# EAGLE design deviantlcd (EAGLE 6.3)
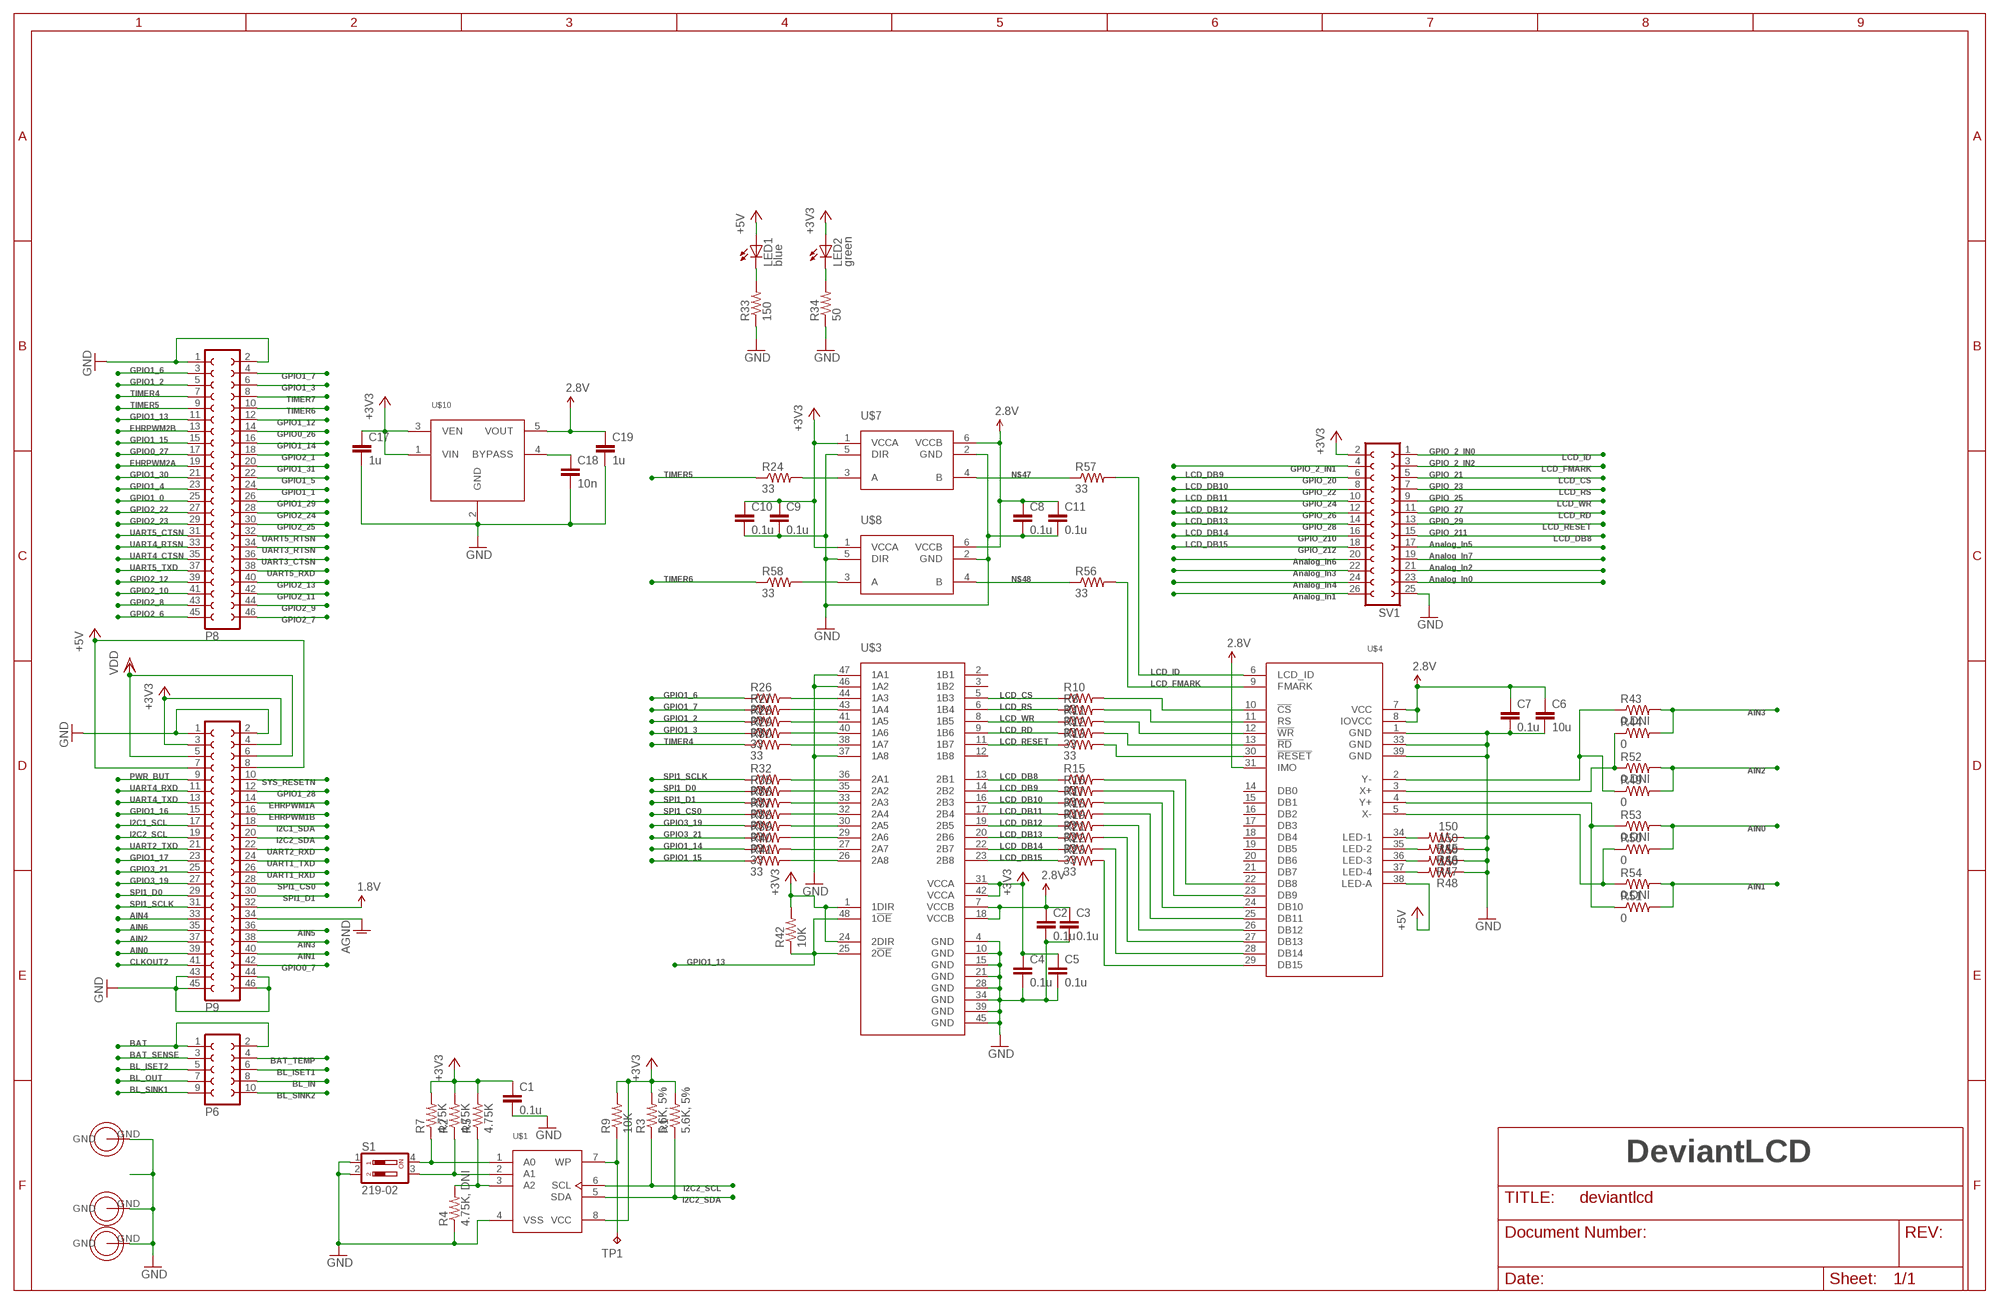
[diagram p0: schematic, sheet 1]

## Parts
C1  0.1u  C-EUC0603  [C0603]
C2  0.1u  C-EUC0603  [C0603]
C3  0.1u  C-EUC0603  [C0603]
C4  0.1u  C-EUC0603  [C0603]
C5  0.1u  C-EUC0603  [C0603]
C6  10u  C-EUC0603  [C0603]
C7  0.1u  C-EUC0603  [C0603]
C8  0.1u  C-EUC0603  [C0603]
C9  0.1u  C-EUC0603  [C0603]
C10  0.1u  C-EUC0603  [C0603]
C11  0.1u  C-EUC0603  [C0603]
C17  1u  C-EUC0603  [C0603]
C18  10n  C-EUC0603  [C0603]
C19  1u  C-EUC0603  [C0603]
H1  HOLE  [HOLE]
H3  HOLE  [HOLE]
H4  HOLE  [HOLE]
LED1  blue  LEDCHIPLED_0603  [CHIPLED_0603]
LED2  green  LEDCHIPLED_0603  [CHIPLED_0603]
P6  FE05-2  [FE05-2]
P8  FE23-2  [FE23-2]
P9  FE23-2  [FE23-2]
R1  5.6K, 5%  R-US_R0603  [R0603]
R2  4.75K  R-US_R0603  [R0603]
R3  5.6K, 5%  R-US_R0603  [R0603]
R4  4.75K, DNI  R-US_R0603  [R0603]
R5  4.75K  R-US_R0603  [R0603]
R7  4.75K  R-US_R0603  [R0603]
R8  33  R-US_R0402  [R0402]
R9  10K  R-US_R0603  [R0603]
R10  33  R-US_R0402  [R0402]
R11  33  R-US_R0402  [R0402]
R12  33  R-US_R0402  [R0402]
R13  33  R-US_R0402  [R0402]
R15  33  R-US_R0402  [R0402]
R16  33  R-US_R0402  [R0402]
R17  33  R-US_R0402  [R0402]
R18  33  R-US_R0402  [R0402]
R19  33  R-US_R0402  [R0402]
R21  33  R-US_R0402  [R0402]
R22  33  R-US_R0402  [R0402]
R23  33  R-US_R0402  [R0402]
R24  33  R-US_R0402  [R0402]
R26  33  R-US_R0402  [R0402]
R27  33  R-US_R0402  [R0402]
R28  33  R-US_R0402  [R0402]
R29  33  R-US_R0402  [R0402]
R30  33  R-US_R0402  [R0402]
R32  33  R-US_R0402  [R0402]
R33  150  R-US_R0603  [R0603]
R34  50  R-US_R0603  [R0603]
R35  33  R-US_R0402  [R0402]
R36  33  R-US_R0402  [R0402]
R37  33  R-US_R0402  [R0402]
R38  33  R-US_R0402  [R0402]
R39  33  R-US_R0402  [R0402]
R40  33  R-US_R0402  [R0402]
R41  33  R-US_R0402  [R0402]
R42  10K  R-US_R0402  [R0402]
R43  0,DNI  R-US_R0402  [R0402]
R44  0  R-US_R0402  [R0402]
R45  150  R-US_R0603  [R0603]
R46  150  R-US_R0603  [R0603]
R47  150  R-US_R0603  [R0603]
R48  150  R-US_R0603  [R0603]
R49  0  R-US_R0402  [R0402]
R50  0  R-US_R0402  [R0402]
R51  0  R-US_R0402  [R0402]
R52  0,DNI  R-US_R0402  [R0402]
R53  0,DNI  R-US_R0402  [R0402]
R54  0,DNI  R-US_R0402  [R0402]
R56  33  R-US_R0402  [R0402]
R57  33  R-US_R0402  [R0402]
R58  33  R-US_R0402  [R0402]
S1  219-02  [CTS-219-02]
SV1  FE13-2  [FE13-2]
TP1  TPB2,54  [B2,54]
U$1  CAT24C256  [SOIC8]
U$3  SN74LVCH16T245  [TSSOP48]
U$4  NHD-2.4-240320SF-CTXI  [NHD-2.4-240320SF-CTXI]
U$7  SN74LVC1T45  [SOT23-6]
U$8  SN74LVC1T45  [SOT23-6]
U$10  LP3985  [SOT23-5]

## Nets
1.8V: P9.32
2.85V [pwr]: C6.1 C7.1 C8.1 C11.1 C19.1 U$4.7(VCC) U$4.8(IOVCC) U$4.31(IMO) U$7.6(VCCB) U$8.6(VCCB) U$10.5(VOUT) ; supply symbol labelled 2.8V
+3V3 [pwr]: C1.1 C4.1 C5.1 C9.1 C10.1 C17.1 LED2.A P9.3 P9.4 R1.2 R2.2 R3.2 R5.2 R7.2 R9.2 R42.2 SV1.2 U$1.8(VCC) U$3.1(1DIR) U$3.24(2DIR) U$3.31(VCCA) U$3.42(VCCA) U$7.1(VCCA) U$8.1(VCCA) U$10.1(VIN) U$10.3(VEN)
+5V [pwr]: LED1.A P9.7 P9.8 U$4.38(LED-A)
AGND: P9.34
AIN0: P9.39 R50.2 R53.2
AIN1: P9.40 R51.2 R54.2
AIN2: P9.37 R49.2 R52.2
AIN3: P9.38 R43.2 R44.2
AIN4: P9.33
AIN5: P9.36
AIN6: P9.35
BAT: P6.1 P6.2
BAT_SENSE: P6.3
BAT_TEMP: P6.4
BL_IN: P6.8
BL_ISET1: P6.6
BL_ISET2: P6.5
BL_OUT: P6.7
BL_SINK1: P6.9
BL_SINK2: P6.10
CLKOUT2: P9.41
EHRPWM1A: P9.14
EHRPWM1B: P9.16
EHRPWM2A: P8.19
EHRPWM2B: P8.13
FF: SV1.4
GND [pwr]: C1.2 C2.2 C3.2 C4.2 C5.2 C6.2 C7.2 C8.2 C9.2 C10.2 C11.2 C17.2 C18.2 C19.2 H1.GND H3.GND H4.GND P8.1 P8.2 P9.1 P9.2 P9.43 P9.44 P9.45 P9.46 R4.1 R33.1 R34.1 R45.1 R46.1 R47.1 R48.1 S1.1 S1.2 SV1.25 U$1.4(VSS) U$3.4(GND) U$3.10(GND) U$3.15(GND) U$3.21(GND) U$3.28(GND) U$3.34(GND) U$3.37(1A8) U$3.39(GND) U$3.45(GND) U$3.46(1A2) U$3.47(1A1) U$4.1(GND) U$4.33(GND) U$4.39(GND) U$7.2(GND) U$7.5(DIR) U$8.2(GND) U$8.5(DIR) U$10.2(GND)
GPIO0_7: P9.42
GPIO0_26: P8.14
GPIO0_27: P8.17
GPIO1_0: P8.25
GPIO1_1: P8.24
GPIO1_2: P8.5 R28.1
GPIO1_3: P8.6 R29.1
GPIO1_4: P8.23
GPIO1_5: P8.22
GPIO1_6: P8.3 R26.1
GPIO1_7: P8.4 R27.1
GPIO1_12: P8.12
GPIO1_13: P8.11 R42.1 U$3.25(2!OE) U$3.48(1!OE)
GPIO1_14: P8.16 R40.1
GPIO1_15: P8.15 R41.1
GPIO1_16: P9.15
GPIO1_17: P9.23
GPIO1_28: P9.12
GPIO1_29: P8.26
GPIO1_30: P8.21
GPIO1_31: P8.20
GPIO2_1: P8.18
GPIO2_6: P8.45
GPIO2_7: P8.46
GPIO2_8: P8.43
GPIO2_9: P8.44
GPIO2_10: P8.41
GPIO2_11: P8.42
GPIO2_12: P8.39
GPIO2_13: P8.40
GPIO2_22: P8.27
GPIO2_23: P8.29
GPIO2_24: P8.28
GPIO2_25: P8.30
GPIO3_19: P9.27 R38.1
GPIO3_21: P9.25 R39.1
I2C1_SCL: P9.17
I2C1_SDA: P9.18
I2C2_SCL: P9.19 R3.1 U$1.6(SCL)
I2C2_SDA: P9.20 R1.1 U$1.5(SDA)
LCD_CS: R10.1 SV1.5 U$3.5(1B3)
LCD_DB8: R15.1 SV1.15 U$3.13(2B1)
LCD_DB9: R16.1 SV1.6 U$3.14(2B2)
LCD_DB10: R17.1 SV1.8 U$3.16(2B3)
LCD_DB11: R18.1 SV1.10 U$3.17(2B4)
LCD_DB12: R19.1 SV1.12 U$3.19(2B5)
LCD_DB13: R21.1 SV1.14 U$3.20(2B6)
LCD_DB14: R22.1 SV1.16 U$3.22(2B7)
LCD_DB15: R23.1 SV1.18 U$3.23(2B8)
LCD_FMARK: R56.2 SV1.3 U$4.9(FMARK)
LCD_ID: R57.2 SV1.1 U$4.6(LCD_ID)
LCD_RD: R12.1 SV1.11 U$3.9(1B6)
LCD_RESET: R13.1 SV1.13 U$3.11(1B7)
LCD_RS: R8.1 SV1.7 U$3.6(1B4)
LCD_WR: R11.1 SV1.9 U$3.8(1B5)
N$1: R7.1 S1.4 U$1.1(A0)
N$2: R2.1 S1.3 U$1.2(A1)
N$3: R4.2 R5.1 U$1.3(A2)
N$5: R9.1 TP1.TP U$1.7(WP)
N$14: SV1.20
N$15: SV1.22
N$16: SV1.24
N$17: SV1.26
N$25: SV1.17
N$26: SV1.19
N$27: SV1.21
N$28: SV1.23
N$29: LED1.C R33.2
N$30: LED2.C R34.2
N$31: R24.2 U$7.3(A)
N$32: R58.2 U$8.3(A)
N$33: R26.2 U$3.44(1A3)
N$34: R27.2 U$3.43(1A4)
N$35: R28.2 U$3.41(1A5)
N$36: R29.2 U$3.40(1A6)
N$37: R30.2 U$3.38(1A7)
N$39: R32.2 U$3.36(2A1)
N$40: R35.2 U$3.35(2A2)
N$41: R36.2 U$3.33(2A3)
N$42: R37.2 U$3.32(2A4)
N$43: R38.2 U$3.30(2A5)
N$44: R39.2 U$3.29(2A6)
N$45: R40.2 U$3.27(2A7)
N$46: R41.2 U$3.26(2A8)
N$47: R57.1 U$7.4(B)
N$48: R56.1 U$8.4(B)
N$81: R10.2 U$4.10(!CS)
N$82: R8.2 U$4.11(RS)
N$83: R11.2 U$4.12(!WR)
N$84: R12.2 U$4.13(!RD)
N$85: R13.2 U$4.30(!RESET)
N$87: R23.2 U$4.29(DB15)
N$88: R22.2 U$4.28(DB14)
N$89: R21.2 U$4.27(DB13)
N$90: R19.2 U$4.26(DB12)
N$91: R18.2 U$4.25(DB11)
N$92: R17.2 U$4.24(DB10)
N$93: R16.2 U$4.23(DB9)
N$94: R15.2 U$4.22(DB8)
N$97: C18.1 U$10.4(BYPASS)
N$99: R45.2 U$4.34(LED-1)
N$100: R46.2 U$4.35(LED-2)
N$101: R47.2 U$4.36(LED-3)
N$102: R48.2 U$4.37(LED-4)
N$103: R43.1 R49.1 U$4.2(Y-)
N$104: R44.1 R52.1 U$4.3(X+)
N$105: R51.1 R53.1 U$4.4(Y+)
N$106: R50.1 R54.1 U$4.5(X-)
PWR_BUT: P9.9
SPI1_CS0: P9.28 R37.1
SPI1_D0: P9.29 R35.1
SPI1_D1: P9.30 R36.1
SPI1_SCLK: P9.31 R32.1
SYS_RESETN: P9.10
TIMER4: P8.7 R30.1
TIMER5: P8.9 R24.1
TIMER6: P8.10 R58.1
TIMER7: P8.8
UART1_RXD: P9.26
UART1_TXD: P9.24
UART2_RXD: P9.22
UART2_TXD: P9.21
UART3_CTSN: P8.36
UART3_RTSN: P8.34
UART4_CTSN: P8.35
UART4_RTSN: P8.33
UART4_RXD: P9.11
UART4_TXD: P9.13
UART5_CTSN: P8.31
UART5_RTSN: P8.32
UART5_RXD: P8.38
UART5_TXD: P8.37
VCCB@2: C2.1 C3.1 U$3.7(VCCB) U$3.18(VCCB) ; supply symbol labelled 2.8V
VDD: P9.5 P9.6
Unconnected: U$3.2(1B1) U$3.3(1B2) U$3.12(1B8) U$4.14(DB0) U$4.15(DB1) U$4.16(DB2) U$4.17(DB3) U$4.18(DB4) U$4.19(DB5) U$4.20(DB6) U$4.21(DB7)

## Notes on the sheet
- GPIO_2_IN0
- GPIO_2_IN1 | GPIO_2_IN2
- GPIO_20 | GPIO_21
- GPIO_22 | GPIO_23
- GPIO_24 | GPIO_25
- GPIO_26 | GPIO_27
- GPIO_28 | GPIO_29
- GPIO_210 | GPIO_211
- GPIO_212 | Analog_In5
- Analog_In6 | Analog_In7
- Analog_In3 | Analog_In2
- Analog_In4 | Analog_In0
- Analog_In1
- DeviantLCD

## Library data of the parts
C1-C5 C7-C11 = rcl:C-EU: CAPACITOR, European symbol; MPN: VJ0603V104ZXXCW1BC
C6 = rcl:C-EU: CAPACITOR, European symbol; MPN: LMK107BBJ106MALT
C17 C19 = rcl:C-EU: CAPACITOR, European symbol; MPN: C1608X7R1C105K
C18 = rcl:C-EU: CAPACITOR, European symbol; MPN: VJ0603Y103KXACW1BC
H1 H3 H4 = BoneCapeParts:HOLE
LED1 = led:LED: LED OSRAM: - CHIPLED LG R971, LG N971, LY N971, LG Q971, LY Q971, LO R971, LY R971 LH N974, LH R974 LS Q976, LO Q976, LY Q976 LO Q996 - Hyper CHIPLED LW Q18S LB Q993, LB Q99A, LB R99A - SideLED LS A670, LO A670, LY A670, LG A670, LP A670 LB A673, LV A673, LT A673, LW A673 LH A674 LY A675 LS A676, LA A676, LO A676, LY A676, LW A676 LS A679, LY A679, LG A679 - Hyper Micro SIDELED® LS Y876, LA Y876, LO Y876, LY Y876 LT Y87S - SmartLED LW L88C, LW L88S LB L89C, LB L89S, LG L890 LS L89K, LO L89K, LY L89K LS L896, LA L896, LO L896, LY L896 - TOPLED LS T670, LO T670, LY T670, LG T670, LP T670 LSG T670, LSP T670, LSY T670, LOP T670, LYG T670 LG T671, LOG T671, LSG T671 LB T673, LV T673, LT T673, LW T673 LH T674 LS T676, LA T676, LO T676, LY T676, LB T676, LH T676, LSB T676, LW T676 LB T67C, LV T67C, LT T67C, LS T67K, LO T67K, LY T67K, LW E67C LS E67B, LA E67B, LO E67B, LY E67B, LB E67C, LV E67C, LT E67C LW T67C LS T679, LY T679, LG T679 LS T770, LO T770, LY T770, LG T770, LP T770 LB T773, LV T773, LT T773, LW T773 LH T774 LS E675, LA E675, LY E675, LS T675 LS T776, LA T776, LO T776, LY T776, LB T776 LHGB T686 LT T68C, LB T68C - Hyper Mini TOPLED® LB M676 - Mini TOPLED Santana® LG M470 LS M47K, LO M47K, LY M47K Source: http://www.osram.convergy.de LUXEON: - LUMILED® LXK2-PW12-R00, LXK2-PW12-S00, LXK2-PW14-U00, LXK2-PW14-V00 LXK2-PM12-R00, LXK2-PM12-S00, LXK2-PM14-U00 LXK2-PE12-Q00, LXK2-PE12-R00, LXK2-PE12-S00, LXK2-PE14-T00, LXK2-PE14-U00 LXK2-PB12-K00, LXK2-PB12-L00, LXK2-PB12-M00, LXK2-PB14-N00, LXK2-PB14-P00, LXK2-PB14-Q00 LXK2-PR12-L00, LXK2-PR12-M00, LXK2-PR14-Q00, LXK2-PR14-R00 LXK2-PD12-Q00, LXK2-PD12-R00, LXK2-PD12-S00 LXK2-PH12-R00, LXK2-PH12-S00 LXK2-PL12-P00, LXK2-PL12-Q00, LXK2-PL12-R00 Source: www.luxeon.com KINGBRIGHT: KA-3528ASYC Source: www.kingbright.com; MPN: HT-193NB-5589
LED2 = led:LED: LED OSRAM: - CHIPLED LG R971, LG N971, LY N971, LG Q971, LY Q971, LO R971, LY R971 LH N974, LH R974 LS Q976, LO Q976, LY Q976 LO Q996 - Hyper CHIPLED LW Q18S LB Q993, LB Q99A, LB R99A - SideLED LS A670, LO A670, LY A670, LG A670, LP A670 LB A673, LV A673, LT A673, LW A673 LH A674 LY A675 LS A676, LA A676, LO A676, LY A676, LW A676 LS A679, LY A679, LG A679 - Hyper Micro SIDELED® LS Y876, LA Y876, LO Y876, LY Y876 LT Y87S - SmartLED LW L88C, LW L88S LB L89C, LB L89S, LG L890 LS L89K, LO L89K, LY L89K LS L896, LA L896, LO L896, LY L896 - TOPLED LS T670, LO T670, LY T670, LG T670, LP T670 LSG T670, LSP T670, LSY T670, LOP T670, LYG T670 LG T671, LOG T671, LSG T671 LB T673, LV T673, LT T673, LW T673 LH T674 LS T676, LA T676, LO T676, LY T676, LB T676, LH T676, LSB T676, LW T676 LB T67C, LV T67C, LT T67C, LS T67K, LO T67K, LY T67K, LW E67C LS E67B, LA E67B, LO E67B, LY E67B, LB E67C, LV E67C, LT E67C LW T67C LS T679, LY T679, LG T679 LS T770, LO T770, LY T770, LG T770, LP T770 LB T773, LV T773, LT T773, LW T773 LH T774 LS E675, LA E675, LY E675, LS T675 LS T776, LA T776, LO T776, LY T776, LB T776 LHGB T686 LT T68C, LB T68C - Hyper Mini TOPLED® LB M676 - Mini TOPLED Santana® LG M470 LS M47K, LO M47K, LY M47K Source: http://www.osram.convergy.de LUXEON: - LUMILED® LXK2-PW12-R00, LXK2-PW12-S00, LXK2-PW14-U00, LXK2-PW14-V00 LXK2-PM12-R00, LXK2-PM12-S00, LXK2-PM14-U00 LXK2-PE12-Q00, LXK2-PE12-R00, LXK2-PE12-S00, LXK2-PE14-T00, LXK2-PE14-U00 LXK2-PB12-K00, LXK2-PB12-L00, LXK2-PB12-M00, LXK2-PB14-N00, LXK2-PB14-P00, LXK2-PB14-Q00 LXK2-PR12-L00, LXK2-PR12-M00, LXK2-PR14-Q00, LXK2-PR14-R00 LXK2-PD12-Q00, LXK2-PD12-R00, LXK2-PD12-S00 LXK2-PH12-R00, LXK2-PH12-S00 LXK2-PL12-P00, LXK2-PL12-Q00, LXK2-PL12-R00 Source: www.luxeon.com KINGBRIGHT: KA-3528ASYC Source: www.kingbright.com; MPN: LG Q971-KN-1
P6 = con-lsta:FE05-2: FEMALE HEADER; MPN: TSHC-105-D-03-255-GT-LF; OC_FARNELL: unknown; OC_NEWARK: unknown
P8 P9 = BoneCapeParts:FE23-2: FEMALE HEADER; MPN: TSHC-123-D-03-255-GT-LF; OC_FARNELL: unknown; OC_NEWARK: unknown
R1 R3 = rcl:R-US_: RESISTOR, American symbol; MPN: RK73B1JTTDD562J
R2 R4 R5 R7 = rcl:R-US_: RESISTOR, American symbol; MPN: CR0603-FX-4751GLF
R8 R10-R13 R15-R19 R21-R24 R26 R27 R29 R30 R32 R35-R41 R56-R58 = rcl:R-US_: RESISTOR, American symbol; MPN: CR0402-JW-330GLF
R9 R42 = rcl:R-US_: RESISTOR, American symbol; MPN: WR06X1002FTL
R28 = rcl:R-US_: RESISTOR, American symbol
R33 R45-R48 = rcl:R-US_: RESISTOR, American symbol; MPN: 302-150-RC
R34 = rcl:R-US_: RESISTOR, American symbol; MPN: 302-49.9-RC
R43 R44 R49-R54 = rcl:R-US_: RESISTOR, American symbol; MPN: ERJ-2GE0R00X
S1 = switch-dil:219-02*: Surface Mount DIP Switch Series 219 SMT CTS Electronic Components Sourc: www.ctscorp.com; MPN: 219-2MST; OC_FARNELL: unknown; OC_NEWARK: unknown
SV1 = BoneCapeParts:FE13-2: FEMALE HEADER; MPN: NPTC132KFMS-RC
TP1 = testpad:TP: Test pad
U$1 = BoneCapeParts:CAT24C256; MPN: CAT24C256WI-GT3
U$3 = BoneCapeParts:SN74LVCH16T245; MPN: SN74LVCH16T245DGGR
U$4 = BoneCapeParts:NHD-2.4-240320SF-CTXI; MPN: NHD-2.4-240320SF-CTXI#-T1
U$7 U$8 = BoneCapeParts:SN74LVC1T45; MPN: SN74LVC1T45DBVR
U$10 = BoneCapeParts:LP3985; MPN: LP3985IM5-2.8/NOPB

## Net classes
0 default: width 0.152 mm, drill 0.381 mm, clearance 0.152 mm
1 pwr: width 0.254 mm, drill 0.381 mm, clearance 0.152 mm

## Board
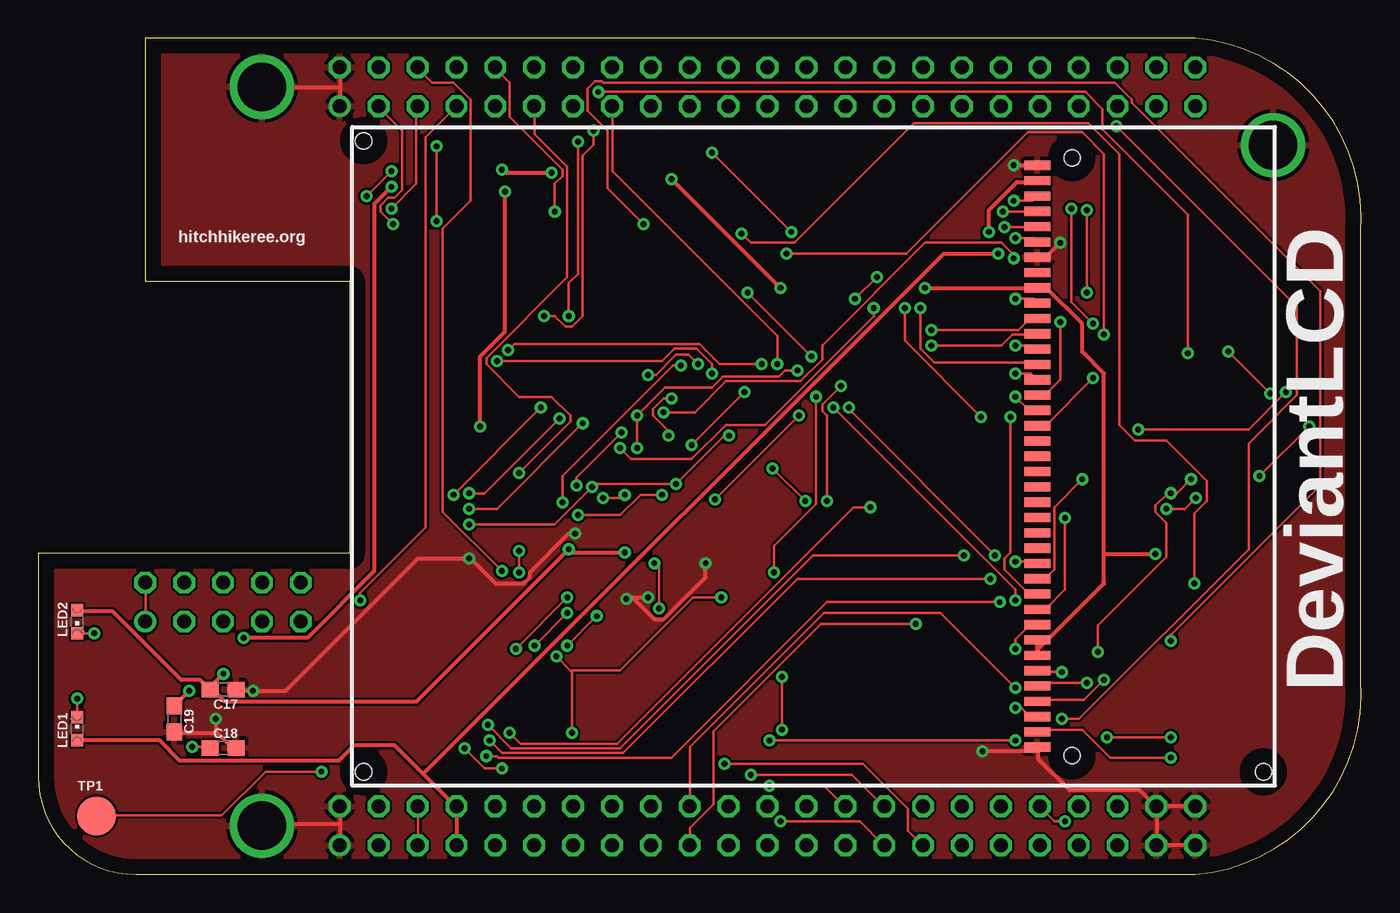
[diagram p1: board, top side]
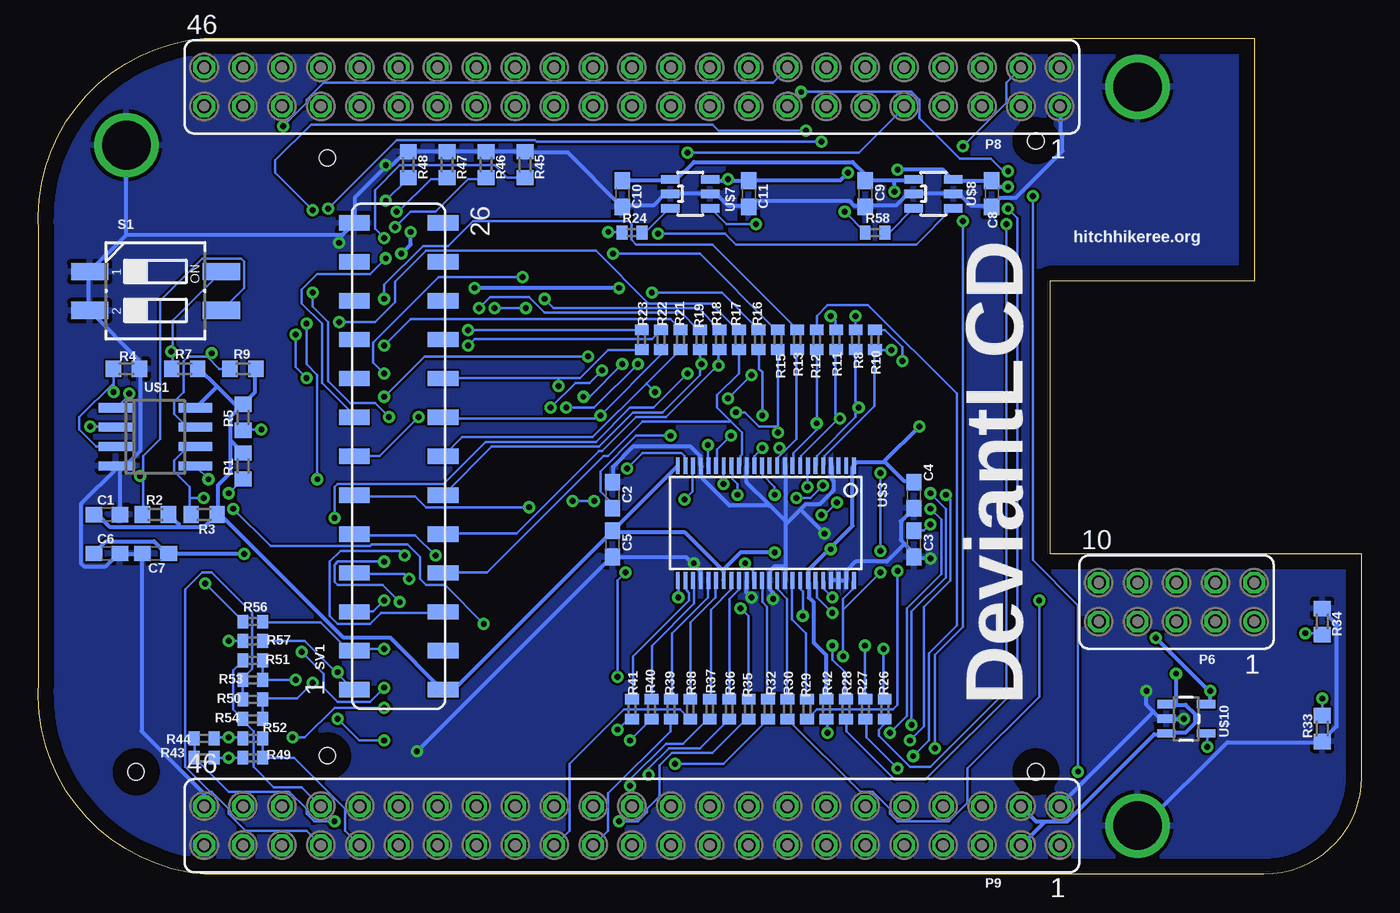
[diagram p2: board, bottom side, seen from below]

Size 86.4 x 54.61 mm. Coordinates in mm from the lower left corner, seen from the top.
Outline: 0,20.95 0,6.35 arc90 6.35,0 75.56,0 arc90 86.36,12.7 86.36,41.91 arc90 75.56,54.61 6.99,54.61 6.99,38.73 20.32,38.73 20.32,20.95 0,20.95
Copper layers (1*16): Top 0.035mm / dielectric 1.5mm / Bottom 0.035mm
Design rules "default *": minimum track width 6mil, minimum drill 15mil, track to track 6mil, track to pad 6mil, pad to pad 6mil, via to via 6mil, smd to smd 6mil, copper to edge 40mil, drill to drill 8mil, minimum pad ring 10mil, minimum via ring 8mil, stop-mask expansion 4mil, vias tented up to drill 20mil, thermal gap 10mil

### Footprints (pad centres in the part's own frame; a part is rotated, then mirrored left to right if it is on the bottom)
C0603 = smd 1.1 x 1: 1 -0.85,0; 2 0.85,0
HOLE = drill 3.175: GND 0,0
CHIPLED_0603 = smd 0.8 x 0.8: A 0,-0.75; C 0,0.75
FE05-2 = drill 0.914: 1 -5.08,1.27 | drill 0.914 octagon: 2 -5.08,-1.27; 3 -2.54,1.27; 4 -2.54,-1.27; 5 0,1.27; 6 0,-1.27; 7 2.54,1.27; 8 2.54,-1.27; 9 5.08,1.27; 10 5.08,-1.27
FE23-2 = drill 0.914: 1 -24.13,1.27 | drill 0.914 octagon: 2 -24.13,-1.27; 3 -21.59,1.27; 4 -21.59,-1.27; 5 -19.05,1.27; 6 -19.05,-1.27; 7 -16.51,1.27; 8 -16.51,-1.27; 9 -13.97,1.27; 10 -13.97,-1.27; 11 -11.43,1.27; 12 -11.43,-1.27; 13 -8.89,1.27; 14 -8.89,-1.27; 15 -6.35,1.27; 16 -6.35,-1.27; 17 -3.81,1.27; 18 -3.81,-1.27; 19 -1.27,1.27; 20 -1.27,-1.27; 21 1.27,1.27; 22 1.27,-1.27; 23 3.81,1.27; 24 3.81,-1.27; 25 6.35,1.27; 26 6.35,-1.27; 27 8.89,1.27; 28 8.89,-1.27; 29 11.43,1.27; 30 11.43,-1.27; 31 13.97,1.27; 32 13.97,-1.27; 33 16.51,1.27; 34 16.51,-1.27; 35 19.05,1.27; 36 19.05,-1.27; 37 21.59,1.27; 38 21.59,-1.27; 39 24.13,1.27; 40 24.13,-1.27; 41 26.67,1.27; 42 26.67,-1.27; 43 29.21,1.27; 44 29.21,-1.27; 45 31.75,1.27; 46 31.75,-1.27
R0603 = smd 1 x 1.1: 1 -0.85,0; 2 0.85,0
R0402 = smd 0.7 x 0.9: 1 -0.65,0; 2 0.65,0
CTS-219-02 = smd 1.13 x 2.44: 1 -1.27,-4.3; 2 1.27,-4.3; 3 1.27,4.3; 4 -1.27,4.3
FE13-2 = smd 1 x 2: 1 -15.24,2.9; 2 -15.24,-2.9; 3 -12.7,2.9; 4 -12.7,-2.9; 5 -10.16,2.9; 6 -10.16,-2.9; 7 -7.62,2.9; 8 -7.62,-2.9; 9 -5.08,2.9; 10 -5.08,-2.9; 11 -2.54,2.9; 12 -2.54,-2.9; 13 0,2.9; 14 0,-2.9; 15 2.54,2.9; 16 2.54,-2.9; 17 5.08,2.9; 18 5.08,-2.9; 19 7.62,2.9; 20 7.62,-2.9; 21 10.16,2.9; 22 10.16,-2.9; 23 12.7,2.9; 24 12.7,-2.9; 25 15.24,2.9; 26 15.24,-2.9
B2,54 = smd 2.54 x 2.54: TP 0,0
SOIC8 = smd 0.6 x 2.2: 1 -1.905,-2.6; 2 -0.635,-2.6; 3 0.635,-2.6; 4 1.905,-2.6; 5 1.905,2.6; 6 0.635,2.6; 7 -0.635,2.6; 8 -1.905,2.6
TSSOP48 = smd 0.25 x 1.1: 1 0.75,1.25; 2 1.25,1.25; 3 1.75,1.25; 4 2.25,1.25; 5 2.75,1.25; 6 3.25,1.25; 7 3.75,1.25; 8 4.25,1.25; 9 4.75,1.25; 10 5.25,1.25; 11 5.75,1.25; 12 6.25,1.25; 13 6.75,1.25; 14 7.25,1.25; 15 7.75,1.25; 16 8.25,1.25; 17 8.75,1.25; 18 9.25,1.25; 19 9.75,1.25; 20 10.25,1.25; 21 10.75,1.25; 22 11.25,1.25; 23 11.75,1.25; 24 12.25,1.25; 25 12.25,8.75; 26 11.75,8.75; 27 11.25,8.75; 28 10.75,8.75; 29 10.25,8.75; 30 9.75,8.75; 31 9.25,8.75; 32 8.75,8.75; 33 8.25,8.75; 34 7.75,8.75; 35 7.25,8.75; 36 6.75,8.75; 37 6.25,8.75; 38 5.75,8.75; 39 5.25,8.75; 40 4.75,8.75; 41 4.25,8.75; 42 3.75,8.75; 43 3.25,8.75; 44 2.75,8.75; 45 2.25,8.75; 46 1.75,8.75; 47 1.25,8.75; 48 0.75,8.75
NHD-2.4-240320SF-CTXI = smd 0.6 x 1.7: 1 -19,14.75; 2 -18,14.75; 3 -17,14.75; 4 -16,14.75; 5 -15,14.75; 6 -14,14.75; 7 -13,14.75; 8 -12,14.75; 9 -11,14.75; 10 -10,14.75; 11 -9,14.75; 12 -8,14.75; 13 -7,14.75; 14 -6,14.75; 15 -5,14.75; 16 -4,14.75; 17 -3,14.75; 18 -2,14.75; 19 -1,14.75; 20 0,14.75; 21 1,14.75; 22 2,14.75; 23 3,14.75; 24 4,14.75; 25 5,14.75; 26 6,14.75; 27 7,14.75; 28 8,14.75; 29 9,14.75; 30 10,14.75; 31 11,14.75; 32 12,14.75; 33 13,14.75; 34 14,14.75; 35 15,14.75; 36 16,14.75; 37 17,14.75; 38 18,14.75; 39 19,14.75 | hole 1.05: 20.61,58.76; -20.61,0; -20.61,58.76; -19.56,12.5; 19.5,12.5
SOT23-6 = smd 0.55 x 1.2: 1 -0.95,-1.3; 2 0,-1.3; 3 0.95,-1.3; 4 0.95,1.3; 5 0,1.3; 6 -0.95,1.3
SOT23-5 = smd 0.55 x 1.2: 1 -0.95,-1.3; 2 0,-1.3; 3 0.95,-1.3; 4 0.95,1.3; 5 -0.95,1.3

### Placement (x,y rotation side)
C1  81.92,23.5 0 bottom
C2  48.9,24.77 90 bottom
C3  29.21,21.59 270 bottom
C4  29.21,24.77 270 bottom
C5  48.9,21.59 270 bottom
C6  81.92,20.95 0 bottom
C7  78.74,20.95 180 bottom
C8  24.13,44.45 270 bottom
C9  32.38,44.45 270 bottom
C10  48.26,44.45 270 bottom
C11  40.01,44.45 270 bottom
C17  12.06,12.06 0 top
C18  12.06,8.26 0 top
C19  8.89,10.16 270 top
H1  14.61,3.17 0 top
H3  14.61,51.44 0 top
H4  80.64,47.62 0 top
LED1  [CHIPLED_0603]  2.54,9.53 0 top
LED2  [CHIPLED_0603]  2.54,16.51 180 top
P6  12.06,17.78 180 bottom
P8  43.81,51.44 180 bottom
P9  43.81,3.17 180 bottom
R1  73.03,26.67 90 bottom
R2  78.74,23.5 0 bottom
R3  75.56,23.5 0 bottom
R4  80.64,33.02 180 bottom
R5  73.03,29.84 90 bottom
R7  76.83,33.02 0 bottom
R8  [R0402]  33.02,34.92 90 bottom
R9  73.03,33.02 0 bottom
R10  [R0402]  31.75,34.92 90 bottom
R11  [R0402]  34.29,34.92 90 bottom
R12  [R0402]  35.56,34.92 90 bottom
R13  [R0402]  36.83,34.92 90 bottom
R15  [R0402]  38.1,34.92 90 bottom
R16  [R0402]  39.37,34.92 90 bottom
R17  [R0402]  40.64,34.92 90 bottom
R18  [R0402]  41.91,34.92 90 bottom
R19  [R0402]  43.18,34.92 90 bottom
R21  [R0402]  44.45,34.92 90 bottom
R22  [R0402]  45.72,34.92 90 bottom
R23  [R0402]  46.99,34.92 90 bottom
R24  [R0402]  47.62,41.91 0 bottom
R26  [R0402]  31.11,10.79 90 bottom
R27  [R0402]  32.38,10.79 90 bottom
R28  [R0402]  33.66,10.79 90 bottom
R29  [R0402]  36.2,10.79 90 bottom
R30  [R0402]  37.47,10.79 90 bottom
R32  [R0402]  38.73,10.79 90 bottom
R33  4.75K  [R0603]  2.54,9.53 90 bottom
R34  4.75K  [R0603]  2.54,16.51 270 bottom
R35  [R0402]  40.01,10.79 90 bottom
R36  [R0402]  41.27,10.79 90 bottom
R37  [R0402]  42.55,10.79 90 bottom
R38  [R0402]  43.81,10.79 90 bottom
R39  [R0402]  45.09,10.79 90 bottom
R40  [R0402]  46.35,10.79 90 bottom
R41  [R0402]  47.62,10.79 90 bottom
R42  34.92,10.79 90 bottom
R43  75.56,7.62 180 bottom
R44  75.56,8.89 180 bottom
R45  4.75K  [R0603]  54.61,46.35 270 bottom
R46  4.75K  [R0603]  57.15,46.35 270 bottom
R47  4.75K  [R0603]  59.69,46.35 270 bottom
R48  4.75K  [R0603]  62.23,46.35 270 bottom
R49  72.39,7.62 0 bottom
R50  72.39,11.43 180 bottom
R51  72.39,13.97 180 bottom
R52  72.39,8.89 0 bottom
R53  72.39,12.7 180 bottom
R54  72.39,10.16 180 bottom
R56  [R0402]  72.39,16.51 0 bottom
R57  [R0402]  72.39,15.24 0 bottom
R58  [R0402]  31.75,41.91 0 bottom
S1  78.74,38.1 270 bottom
SV1  62.87,27.3 90 bottom
TP1  3.81,3.81 0 top
U$1  78.74,28.57 270 bottom
U$3  32.38,27.94 180 bottom
U$4  80.01,27.3 90 top
U$7  43.81,44.45 270 bottom
U$8  27.94,44.45 270 bottom
U$10  11.43,10.16 270 bottom

### Tracks (layer width: path | path; a pad name or v marks a point on that pad's centre or on a via)
2.85V  (via drill 0.38)
  Top 0.254: 65.23,14.73 65.23,15.24 U$4.8 | 65.23,14.73 65.23,14.33 U$4.7 | 69.6,20.93 69.6,19 65.33,14.73 65.23,14.73 | 69.6,20.93 69.6,32.72 68.17,34.14 68.17,35.97 65.84,38.3 65.33,38.3 U$4.31 65.23,38.3 v57.91,38.3 | 69.6,20.93 v72.95,20.93 | v9.86,11.99 8.94,11.07 C19.1 | v13.41,15.44 17.58,15.44 21.95,19.81 21.95,43.79 v23.06,44.91 | v33.53,45.82 30.48,45.82 v30.28,46.02 | v41.35,45.41 v48.46,38.3
  Bottom 0.254: C6.1 82.7,21.03 81.99,21.74 78.84,21.74 78.13,21.03 77.93,21.03 C7.1 77.83,20.93 v72.95,20.93 | 41.35,45.31 42.47,45.31 U$7.6 | 41.35,45.31 40.03,45.31 C11.1 39.93,45.31 34.04,45.31 v33.53,45.82 | U$10.5 10.06,11.18 9.86,11.38 v9.86,11.99 9.96,11.99 v13.41,15.44 | v23.06,44.91 23.77,44.91 24.08,45.21 C8.1 24.18,45.31 26.62,45.31 U$8.6 26.72,45.41 27.33,46.02 v30.28,46.02 | v48.46,38.3 v57.91,38.3 | v41.35,45.41 41.35,45.31
+3V3  (via drill 0.38)
  Top 0.254: LED2.A 2.54,17.17 4.88,17.17 9.35,12.7 10.57,12.7 11.18,12.09 C17.1 | v12.09,13.11 11.18,12.19 C17.1 | v30.48,44.6 30.48,35.46 28.85,33.83 v28.85,29.26 | C17.1 11.28,11.99 11.48,11.99 12.19,11.28 24.69,11.28 v34.65,21.23 34.54,21.03 v38.3,21.03
  Bottom 0.254: 73.81,28.3 73.86,28.35 73.86,29.87 73.05,30.68 R5.2 | 73.81,28.3 73.05,27.53 R1.2 | R9.2 72.24,33.02 72.24,31.5 72.95,30.79 R5.2 | R3.2 74.68,23.57 74.68,25.4 73.86,26.21 73.86,28.25 73.81,28.3 | 74.73,31.85 73.36,30.48 R5.2 | 74.73,31.85 75.89,33.02 R7.2 | 77.22,22.76 77.22,22.86 77.83,23.47 R2.2 | 77.22,22.76 77.11,22.66 75.59,22.66 74.78,23.47 R3.2 | C1.1 82.7,23.47 82.5,23.47 81.69,22.66 77.22,22.66 77.22,22.76 | 74.73,31.85 76.1,30.48 U$1.8 | 41.66,19.81 41.66,19.2 U$3.31 | 41.66,19.81 44.2,22.35 48.87,22.35 C5.1 | U$3.24 44.7,26.62 48.87,22.45 C5.1 | C5.1 48.97,22.35 59.23,12.09 59.94,12.09 SV1.2 60.05,12.09 63.4,15.44 66.45,15.44 74.57,23.57 R3.2 | 12.09,11.07 12.7,11.07 U$10.1 | 12.09,11.07 11.48,11.07 10.87,10.46 10.87,9.86 11.48,9.25 12.7,9.25 U$10.3 12.8,9.14 13.51,9.14 19.2,3.45 20.73,3.45 | 20.73,3.45 21.23,3.45 P9.4 | P9.3 22.15,1.93 20.73,3.35 20.73,3.45 | 12.09,11.07 v12.09,13.11 | 30.48,45.31 29.26,45.31 U$8.1 | 30.48,45.31 32.31,45.31 C9.1 32.41,45.41 32.41,45.72 33.22,46.53 43.59,46.53 44.7,45.41 45.01,45.41 U$7.1 45.21,45.31 48.26,45.31 C10.1 | 31.09,26.92 29.87,25.7 29.26,25.7 C4.1 | 31.09,26.92 32.92,26.92 33.12,26.72 U$3.1 33.22,26.62 33.22,22.76 34.7,21.29 | R42.2 34.95,11.48 34.95,14.33 35.76,15.14 35.76,17.78 36.07,18.09 36.07,19.1 U$3.42 36.07,19.3 36.07,19.91 34.7,21.29 | v30.48,44.6 30.48,45.31 | v28.85,29.26 31.09,27.03 31.09,26.92 | v34.65,21.23 34.7,21.29 | v38.3,21.03 40.54,21.03 41.66,19.91 41.66,19.81
+5V  (via drill 0.38)
  Top 0.254: 25.15,6.55 27.23,4.47 P9.8 27.33,4.37 27.33,1.93 P9.7 | 25.15,6.55 23.27,8.43 20.62,8.43 19.61,7.42 9.25,7.42 7.92,8.74 2.54,8.74 LED1.A | v62.08,41.96 62.08,43.38 63.91,45.21 65.23,45.21 U$4.38 | v62.69,40.54 59.13,40.54 25.15,6.55
  Bottom 0.254: v62.08,41.96 62.08,41.15 v62.69,40.54
AIN0
  Bottom 0.152: R50.2 73.05,11.48 R53.2 72.95,12.7 72.95,12.9 72.44,13.41 72.44,17.07 75.08,19.71 75.69,19.71 76.81,18.59 76.81,7.01 75.18,5.38 75.08,5.38 73.97,4.27 73.97,3.96 72.85,2.85 68.89,2.85 P9.39
AIN1
  Bottom 0.152: R51.2 73.05,13.92 73.66,13.31 73.66,10.77 R54.2 72.95,10.16 72.95,9.96 72.34,9.35 72.34,7.01 71.02,5.69 69.19,5.69 P9.40
AIN2
  Bottom 0.152: R49.2 71.73,8.84 R52.2 | R49.2 69.7,7.62 66.34,4.27 66.34,2.85 P9.37 | R49.2
AIN3  (via drill 0.38)
  Top 0.152: v67.06,3.45 66.34,3.45 65.43,4.37 P9.38
  Bottom 0.152: 76.2,7.62 76.2,8.84 R44.2 | 76.2,7.62 73.97,5.38 70,5.38 68.89,4.27 68.89,3.96 68.38,3.45 v67.06,3.45 | 76.2,7.62 R43.2
BAT
  Top 0.152: P6.1 7.01,16.56 7.01,19 P6.2
GND  (via drill 0.38)
  Top 0.254: 38.91,18.09 38.51,18.09 v38.41,17.98 | 38.91,18.09 v39.83,18.09 | v43.59,20.32 43.59,19.41 40.84,16.66 40.23,16.66 38.91,17.98 38.91,18.09 | 11.58,9.25 8.94,9.25 C19.2 | 11.58,9.25 11.68,9.25 12.6,8.33 12.9,8.33 C18.2 | C17.2 13.01,11.99 v14.02,11.99 16.15,11.99 24.79,20.62 v28.14,20.62 28.25,20.62 29.87,19 31.7,19 32.11,19.41 32.11,19.71 34.65,22.25 v35.05,22.25 | v11.58,10.16 11.58,9.25 | 19.71,3.25 19.71,4.37 P9.2 | 19.71,3.25 19.71,1.93 P9.1 | 19.71,3.25 14.63,3.25 H1.GND | P9.44 72.95,4.47 71.93,5.49 67.36,5.49 65.33,7.52 65.33,8.23 U$4.1 65.23,8.03 v61.67,8.03 | P9.44 73.05,4.37 73.05,1.93 P9.43 73.15,1.93 75.49,1.93 P9.45 | P9.46 75.49,4.47 73.15,4.47 P9.44 | 19.71,51.41 19.71,52.63 P8.2 | 19.71,51.41 19.71,50.19 P8.1 | 19.71,51.41 14.63,51.41 H3.GND | v66.75,41.25 65.84,40.34 65.33,40.34 U$4.33 | v63.7,46.33 65.23,46.33 U$4.39
  Bottom 0.254: R34.1 2.54,17.27 1.63,16.36 1.63,9.65 2.54,8.74 R33.1 2.64,8.64 8.74,8.64 14.12,3.25 14.53,3.25 H1.GND | 43.64,20.27 44.09,20.73 48.87,20.73 C5.2 48.97,20.73 v61.67,8.03 | 43.64,20.27 43.18,19.81 43.18,19.2 U$3.28 | 37.59,23.16 37.59,26.62 U$3.10 | 37.59,23.16 37.59,22.96 | 37.59,22.96 37.59,20.12 | 37.59,20.12 37.59,19.2 U$3.39 | 37.59,20.12 38.3,20.12 38.61,19.81 38.61,19.2 U$3.37 38.61,19.1 38.61,18.59 38.41,18.39 v38.41,17.98 | v39.83,18.09 40.13,18.39 40.13,19.1 U$3.34 | 36.63,23.82 37.49,22.96 37.59,22.96 | 36.63,23.82 36.27,24.18 35.36,24.18 34.44,25.09 34.44,25.7 34.54,25.81 34.54,26.62 U$3.4 | 38.66,24.13 37.69,23.16 37.59,23.16 | 38.66,24.13 40.13,25.6 40.13,26.62 U$3.15 | 38.66,24.13 38.71,24.08 41.25,24.08 43.08,25.91 43.08,26.62 U$3.21 43.18,26.72 43.18,27.33 43.79,27.94 47.55,27.94 48.87,26.62 48.87,25.7 C2.2 | v43.59,20.32 43.64,20.27 | U$3.45 34.54,19.2 34.24,19.2 U$3.46 34.04,19.2 33.73,19.2 U$3.47 33.63,19.3 33.63,19.81 33.02,20.42 30.99,20.42 29.82,21.59 | 29.82,21.59 30.07,21.84 30.07,23.06 29.26,23.88 C4.2 | 29.82,21.59 29.26,21.03 29.26,20.83 C3.2 29.16,20.62 v28.14,20.62 | v14.02,11.99 14.02,11.07 13.56,10.62 | 13.56,10.62 13.11,10.16 U$10.2 v11.58,10.16 | 13.56,10.62 19.71,4.47 P9.2 | v35.05,22.25 36.63,23.82 | C1.2 81.08,23.57 81.08,26.42 81.28,26.62 U$1.4 | U$1.4 81.28,26.52 83.62,24.18 83.62,20.32 83.41,20.12 81.99,20.12 81.18,20.93 C6.2 80.97,20.93 79.65,20.93 C7.2 79.65,20.83 79.65,9.35 75.59,5.28 75.59,4.47 P9.46 | U$1.4 80.97,26.42 79.76,27.64 79.76,32.92 R4.1 79.86,33.02 79.86,33.63 83.01,36.78 S1.2 83.11,36.88 83.11,39.32 S1.1 83.01,39.42 80.67,41.76
  Bottom 0.254: 80.67,41.76 80.67,47.55 H4.GND | v66.75,41.25 66.75,41.55 66.6,41.71 | 66.6,41.71 65.84,42.47 SV1.25 65.73,42.67 65.73,44.2 63.7,46.23 v63.7,46.33 63.3,46.33 62.48,47.14 62.28,47.14 R48.1 62.18,47.24 59.74,47.24 R47.1 59.64,47.24 57.2,47.24 R46.1 57.1,47.24 54.66,47.24 R45.1 54.56,47.14 51.82,47.14 48.36,43.69 C10.2 48.26,43.69 46.23,43.69 45.52,44.4 45.21,44.4 U$7.2 45.01,44.5 42.57,44.5 U$7.5 42.47,44.4 42.06,44.4 41.35,43.69 40.03,43.69 C11.2 39.93,43.69 39.62,43.99 33.43,43.99 33.12,43.69 32.41,43.69 C9.2 32.31,43.69 30.38,43.69 29.67,44.4 29.26,44.4 U$8.2 29.16,44.5 26.72,44.5 U$8.5 26.62,44.4 26.21,44.4 25.5,43.69 24.18,43.69 C8.2 24.08,43.69 23.57,44.2 22.55,44.2 19.51,47.24 19.51,48.26 19.61,48.36 19.61,50.09 P8.1 | 80.67,41.76 66.65,41.76 66.6,41.71
  pour Top: 1.27,59.69 90.17,60.96 90.81,0.64 0.64,0 0,60.33
  pour Bottom: 0.64,57.15 90.81,57.15 90.17,0.64 0,0.64
GPIO1_2  (via drill 0.38)
  Top 0.152: v23.06,43.48 24.69,45.11 24.69,50.09 P8.5
  Bottom 0.152: v23.06,43.48 22.45,42.88 22.45,12.19 28.45,6.2 30.48,6.2 33.63,9.35 33.63,10.06 R28.1
GPIO1_3  (via drill 0.38)
  Top 0.152: v30.28,19.81 26.42,23.67 26.42,42.16 28.25,43.99 28.25,50.6 27.13,51.71 25.7,51.71 24.79,52.63 P8.6
  Bottom 0.152: v30.28,19.81 30.28,11.07 30.58,10.77 35.56,10.77 36.17,10.16 R29.1
GPIO1_6  (via drill 0.38)
  Top 0.152: v23.16,42.47 22.35,43.28 22.35,43.69 22.86,44.2 23.27,44.2 23.77,44.7 23.77,48.56 22.25,50.09 P8.3
  Bottom 0.152: v23.16,42.47 23.16,11.99 28.14,7.01 29.46,7.01 31.5,9.04 31.5,9.45 31.19,9.75 31.19,10.06 R26.1
GPIO1_7  (via drill 0.38)
  Top 0.152: v30.28,6.91 29.16,6.91 v27.84,8.23 | v26.01,47.55 v26.01,42.67
  Bottom 0.152: v30.28,6.91 32.31,8.94 32.31,10.06 R27.1 | v27.84,8.23 27.84,14.33 26.01,16.15 v26.01,42.67 | v26.01,47.55 23.16,50.39 23.16,51.71 22.25,52.63 P8.4
GPIO1_13  (via drill 0.38)
  Top 0.152: v34.85,9.25 34.85,13.21 34.8,13.26 | v33.83,14.22 34.8,13.26 | v44.6,18.09 42.77,18.09 38,13.31 34.85,13.31 34.8,13.26 | v31.39,26.21 34.75,29.57 34.75,29.97 33.53,31.19 31.39,31.19 29.26,33.33 29.26,33.73 34.54,39.01 34.54,46.23 32.41,48.36 32.41,50.09 P8.11 | v31.39,19.71 v31.39,21.13
  Bottom 0.152: v34.85,9.25 34.85,10.06 R42.1 | 33.83,17.27 33.83,17.98 33.22,18.59 33.22,19.1 U$3.48 | 33.83,17.27 v33.83,14.22 | v44.6,18.09 44.6,19.1 U$3.25 | v31.39,21.13 v31.39,26.21 | 33.83,17.27 v31.39,19.71
GPIO1_14  (via drill 0.38)
  Top 0.152: v63.8,8.74 v47.75,8.74 | v66.85,10.16 67.97,10.16 79.05,21.23 79.05,28.14 82.19,31.29 82.19,37.08 v70.41,48.87
  Bottom 0.152: v47.75,8.74 46.43,10.06 R40.1 | v63.8,8.74 65.43,8.74 v66.85,10.16 | v70.41,48.87 68.89,50.39 68.89,50.6 67.77,51.71 38.41,51.71 37.49,52.63 P8.16
GPIO1_15  (via drill 0.38)
  Top 0.152: v48.56,12.9 v48.56,9.45 | v48.06,19.71 48.06,21.44 50.8,24.18 v50.8,31.19 | v48.26,33.33 48.26,35.15 37.49,45.92 37.49,50.09 P8.15
  Bottom 0.152: v48.56,9.45 47.95,10.06 47.65,10.06 R41.1 | v48.56,12.9 48.56,19.2 v48.06,19.71 | v50.8,31.19 50.39,31.19 v48.26,33.33
GPIO3_19
  Bottom 0.152: R38.1 43.89,10.16 44.5,10.77 48.16,10.77 51.71,7.21 51.71,2.85 52.63,1.93 P9.27
GPIO3_21
  Bottom 0.152: R39.1 45.11,10.06 45.11,9.35 49.17,5.28 49.17,2.85 50.09,1.93 P9.25
I2C2_SCL  (via drill 0.38)
  Top 0.152: v57.3,16.36 51.1,16.36 44.09,9.35 44.09,4.57 42.57,3.05 42.57,1.93 P9.19 | v73.66,23.88 74.88,23.88 v75.59,24.59
  Bottom 0.152: 76.5,24.59 76.5,25.3 77.52,26.31 77.52,27.03 76.61,27.94 U$1.6 | 76.5,24.59 76.5,23.57 R3.1 | v57.3,16.36 59.84,18.9 61.06,18.9 61.47,19.3 61.47,20.73 62.28,21.54 64.62,21.54 64.72,21.44 71.22,21.44 v73.66,23.88 | 76.5,24.59 v75.59,24.59
I2C2_SDA  (via drill 0.38)
  Top 0.152: v75.29,25.81 74.37,24.89 v73.97,24.89 73.76,24.89 72.95,24.08 72.95,23.67 73.66,22.96 73.66,20.73 69.19,16.26 v69.19,14.53 | v63.8,12.19 58.93,17.07 51.31,17.07 42.57,8.33 42.57,4.47 P9.20
  Bottom 0.152: v73.97,24.89 73.05,25.81 R1.1 | v75.29,25.81 76.1,26.62 U$1.5 | v63.8,12.19 64.72,11.28 66.85,11.28 67.77,12.19 67.77,13.11 v69.19,14.53
LCD_CS  (via drill 0.38)
  Top 0.152: v63.8,17.88 63.8,18.59 v51.92,30.48 | v47.24,33.33 44.5,33.33 43.18,34.65 31.09,34.65 v30.68,34.24
  Bottom 0.152: U$3.5 35.05,26.72 35.05,27.33 31.8,30.58 31.8,34.24 R10.1 31.7,34.24 v30.68,34.24 | v63.8,17.88 64.52,17.17 65.73,17.17 SV1.5 | v51.92,30.48 50.09,30.48 v47.24,33.33
LCD_DB8  (via drill 0.38)
  Top 0.152: v38.1,28.85 35.15,25.91 v35.15,25.4 | v36.88,24.59 38.1,24.59 v38.3,24.79 | v63.7,40.23 63.7,40.44 62.89,41.25 57.91,41.25 51.21,34.54 51.21,33.63 49.78,32.21 44.91,32.21 42.88,30.18 v40.84,30.18
  Bottom 0.152: v38.1,28.85 38.1,29.26 | 38.1,29.26 R15.1 | v35.15,25.4 35.97,24.59 v36.88,24.59 | v38.3,24.79 38.3,25.3 39.12,26.11 39.12,26.62 U$3.13 | v63.7,40.23 64.72,39.22 68.17,39.22 69.19,38.2 69.19,37.29 67.87,35.97 67.87,32.11 65.84,30.07 65.84,29.87 SV1.15 | v40.84,30.18 40.23,30.18 39.32,29.26 38.1,29.26
LCD_DB9  (via drill 0.38)
  Top 0.152: v39.12,27.84 v39.12,29.97 40.95,31.8 43.99,31.8 44.7,32.51 48.36,32.51 48.77,32.92 v49.58,32.92 | v62.48,20.83 52.93,30.38 v52.93,30.48
  Bottom 0.152: v39.12,29.97 39.12,32.82 39.32,33.02 39.32,34.24 R16.1 | v39.12,27.84 39.62,27.33 39.62,26.72 U$3.14 | v62.48,20.83 62.79,21.13 66.65,21.13 67.36,20.42 67.36,16.87 66.85,16.36 64.72,16.36 64.01,17.07 60.05,17.07 SV1.6 | v52.93,30.48 51.31,32.11 50.39,32.11 v49.58,32.92
LCD_DB10
  Bottom 0.152: R17.1 40.64,32.72 42.06,31.29 42.06,30.48 41.2,29.62 | 41.2,29.62 40.44,28.85 40.44,27.43 40.54,27.33 40.54,26.72 U$3.16 | SV1.8 59.94,19.71 57.1,19.71 49.48,27.33 49.17,27.33 46.94,29.57 41.25,29.57 41.2,29.62
LCD_DB11  (via drill 0.38)
  Top 0.152: v40.74,24.79 39.32,24.79 38,23.47 v35.26,23.47 | v34.24,24.28 34.24,26.01 41.45,33.22 v41.96,33.22
  Bottom 0.152: 42.01,33.27 45.41,29.87 47.35,29.87 49.58,27.64 49.78,27.64 55.17,22.25 59.94,22.25 SV1.10 | 42.01,33.27 41.96,33.33 41.96,34.24 R18.1 | v40.74,24.79 40.74,25.5 41.05,25.81 41.05,26.62 U$3.17 | v35.26,23.47 35.05,23.47 v34.24,24.28 | v41.96,33.22 42.01,33.27
LCD_DB12  (via drill 0.38)
  Top 0.152: v41.15,28.65 41.15,28.96 40.13,29.97 40.13,30.38 40.84,31.09 v41.35,31.09 | v39.83,32.61 40.34,32.61 41.66,33.93 42.47,33.93 v43.08,33.33
  Bottom 0.152: 43.18,33.33 43.18,32.61 45.62,30.18 47.55,30.18 49.78,27.94 56.79,27.94 59.94,24.79 SV1.12 | 43.18,33.33 R19.1 | v41.15,28.65 42.06,27.74 42.06,26.72 U$3.19 | v39.83,32.61 v41.35,31.09 | 43.18,33.33 v43.08,33.33
LCD_DB13  (via drill 0.38)
  Top 0.152: v46.13,31.5 v42.67,28.04
  Bottom 0.152: 46.69,32.05 50.19,28.55 58.73,28.55 59.94,27.33 SV1.14 | 46.69,32.05 44.5,34.24 R21.1 | v42.67,28.04 42.67,26.72 U$3.20 | 46.69,32.05 v46.13,31.5
LCD_DB14  (via drill 0.38)
  Top 0.152: v49.68,29.97 v44.2,24.49
  Bottom 0.152: R22.1 45.72,33.93 v49.68,29.97 49.89,29.77 59.94,29.77 SV1.16 | v44.2,24.49 43.69,24.99 43.69,26.62 U$3.22
LCD_DB15  (via drill 0.38)
  Top 0.152: v50.09,24.38 v47.95,26.52 | v51.51,24.38 51.51,29.97 51.21,30.28 51.21,30.68 v52.43,31.9
  Bottom 0.152: 52.43,32.41 59.94,32.41 SV1.18 | 52.43,32.41 51,32.41 49.17,34.24 47.04,34.24 R23.1 | v47.95,26.52 46.94,27.53 44.4,27.53 44.2,27.33 44.2,26.72 U$3.23 | v51.51,24.38 v50.09,24.38 | 52.43,32.41 v52.43,31.9
LCD_FMARK  (via drill 0.38)
  Top 0.152: v63.8,14.73 63.8,15.34 64.72,16.26 65.23,16.26 U$4.9
  Bottom 0.152: R56.2 71.73,16.46 67.97,16.46 66.14,14.63 65.84,14.63 SV1.3 66.14,14.73 v63.8,14.73
LCD_ID  (via drill 0.38)
  Top 0.152: v66.85,13.21 65.33,13.21 U$4.6
  Bottom 0.152: R57.2 68.99,15.24 66.9,13.16 | 66.9,13.16 65.84,12.09 SV1.1 | v66.85,13.21 66.9,13.16
LCD_RD  (via drill 0.38)
  Top 0.152: v54.36,23.98 53.24,23.98 37.8,8.53 31.5,8.53 v30.79,9.25 | v28.14,23.88 29.97,23.88 v35.56,29.46
  Bottom 0.152: R12.1 v35.56,29.46 35.56,29.06 37.08,27.53 37.08,26.72 U$3.9 | v54.36,23.98 61.06,23.98 61.77,24.69 65.73,24.69 SV1.11 | v30.79,9.25 29.67,10.36 29.67,17.37 27.43,19.61 27.43,23.16 v28.14,23.88
LCD_RESET  (via drill 0.38)
  Top 0.152: v61.57,29.87 56.59,34.85 v56.59,36.98 | v54.56,36.98 54.56,36.47 47.45,29.36 44.91,29.36 42.67,27.13 38.71,27.13 v38,27.84
  Bottom 0.152: 37.74,27.58 38.1,27.23 38.1,26.72 U$3.11 | 37.74,27.58 36.88,28.45 36.88,34.24 R13.1 | v61.57,29.87 64.11,27.33 65.73,27.33 SV1.13 | v54.56,36.98 v56.59,36.98 | 37.74,27.58 v38,27.84
LCD_RS  (via drill 0.38)
  Top 0.152: v62.18,19.3 49.58,19.3 38.2,7.92 30.28,7.92 v29.46,8.74 | v32.82,30.48 v27.13,24.79
  Bottom 0.152: 33.02,30.48 33.02,29.87 35.56,27.33 35.56,26.72 U$3.6 | 33.02,30.48 R8.1 | v62.18,19.3 62.48,19.61 65.73,19.61 SV1.7 | v29.46,8.74 28.55,9.65 28.55,17.48 26.82,19.2 26.82,24.49 v27.13,24.79 | 33.02,30.48 v32.82,30.48
LCD_WR  (via drill 0.38)
  Top 0.152: v60.45,20.83 50.6,20.83 38,8.23 30.89,8.23 v29.36,9.75 | v28.14,24.89 29.16,24.89 v34.04,29.77
  Bottom 0.152: 34.34,29.77 34.34,29.57 36.58,27.33 36.58,26.72 U$3.8 | 34.34,29.77 34.34,34.24 R11.1 | v60.45,20.83 61.77,22.15 65.73,22.15 SV1.9 | v29.36,9.75 29.36,17.17 27.13,19.41 27.13,23.88 v28.14,24.89 | 34.34,29.77 v34.04,29.77
N$1  (via drill 0.38)
  Top 0.152: v77.72,34.14 v80.47,31.39
  Bottom 0.152: 77.62,34.14 77.62,36.17 74.47,39.32 S1.4 | 77.62,34.14 77.62,33.02 R7.1 | v80.47,31.39 80.47,31.29 81.28,30.48 U$1.1 | 77.62,34.14 v77.72,34.14
N$2  (via drill 0.38)
  Top 0.152: v79.76,26.01 v83.01,29.26
  Bottom 0.152: 79.55,26.01 79.55,27.33 78.44,28.45 78.44,37.49 75.69,40.23 73.15,40.23 72.95,40.03 72.95,38.3 74.37,36.88 S1.3 | 79.55,26.01 79.55,23.57 R2.1 | v83.01,29.26 81.38,29.26 U$1.2 | 79.55,26.01 v79.76,26.01
N$3  (via drill 0.38)
  Top 0.152: v71.83,29.06 79.05,29.06 v81.48,31.5
  Bottom 0.152: v71.83,29.06 72.95,29.06 R5.1 | 81.48,32.11 R4.2 | 81.48,32.11 v81.48,31.5 | U$1.3 82.6,27.94 83.72,29.06 83.72,29.87 81.48,32.11
N$5  (via drill 0.38)
  Top 0.152: v18.49,6.71 14.83,6.71 11.99,3.86 3.86,3.86 TP1.TP | v23.06,45.92 v21.44,44.3 | v36.58,51.1 68.38,51.1 69.49,49.99 69.49,48.67 75.08,43.08 v75.08,34.04
  Bottom 0.152: R9.1 74.57,33.02 75.34,33.78 | 75.34,33.78 75.39,33.83 76.61,33.83 76.91,33.53 76.91,31.5 77.52,30.89 77.52,30.07 76.71,29.26 76.2,29.26 U$1.7 | v18.49,6.71 18.49,17.58 21.44,20.52 v21.44,44.3 | v23.06,45.92 23.37,45.92 24.18,46.74 26.21,46.74 28.85,49.38 28.85,50.6 29.36,51.1 v36.58,51.1 | 75.34,33.78 v75.08,34.04
N$29  (via drill 0.38)
  Top 0.152: v2.54,11.48 LED1.C
  Bottom 0.152: R33.2 v2.54,11.48
N$30  (via drill 0.38)
  Top 0.152: v3.66,15.75 2.54,15.75 LED2.C
  Bottom 0.152: v3.66,15.75 2.54,15.75 R34.2
N$31
  Bottom 0.152: R24.2 46.94,41.96 46.74,41.96 45.21,43.48 U$7.3
N$32
  Bottom 0.152: R58.2 31.09,41.96 30.79,41.96 29.26,43.48 U$8.3
N$33  (via drill 0.38)
  Top 0.152: v34.54,18.09 v31.19,14.73
  Bottom 0.152: v31.19,14.73 31.19,11.48 R26.2 | v34.54,18.09 35.05,18.59 35.05,19.1 U$3.44
N$34  (via drill 0.38)
  Top 0.152: v34.54,17.07 v32.41,14.94
  Bottom 0.152: v32.41,14.94 32.41,11.48 R27.2 | v34.54,17.07 35.56,18.09 35.56,19.1 U$3.43
N$35  (via drill 0.38)
  Top 0.152: v36.47,16.87 v34.54,14.94
  Bottom 0.152: v34.54,14.94 34.54,14.02 33.73,13.21 33.73,11.48 R28.2 | v36.47,16.87 36.47,18.49 36.58,18.59 36.58,19.1 U$3.41
N$36
  Bottom 0.152: R29.2 36.27,11.48 36.27,15.75 37.19,16.66 37.19,19.1 U$3.40
N$37
  Bottom 0.152: R30.2 37.49,11.48 37.49,17.98 38.1,18.59 38.1,19.1 U$3.38
N$39
  Bottom 0.152: R32.2 38.81,11.48 38.81,17.48 39.12,17.78 39.12,19.1 U$3.36
N$40  (via drill 0.38)
  Top 0.152: v40.54,17.37 40.54,20.02 v40.23,20.32
  Bottom 0.152: v40.54,17.37 40.03,16.87 40.03,11.48 R35.2 | v40.23,20.32 39.73,19.81 39.73,19.2 U$3.35
N$41
  Bottom 0.152: R36.2 41.25,11.48 41.25,17.98 40.64,18.59 40.64,19.1 U$3.33
N$42
  Bottom 0.152: R37.2 42.47,11.48 42.47,17.27 41.15,18.59 41.15,19.1 U$3.32
N$43
  Bottom 0.152: R38.2 43.79,11.48 43.79,16.46 42.16,18.09 42.16,19.1 U$3.30
N$44
  Bottom 0.152: R39.2 45.01,11.48 45.01,15.75 42.67,18.09 42.67,19.1 U$3.29
N$45
  Bottom 0.152: R40.2 46.33,11.48 46.33,14.94 43.59,17.68 43.59,19.1 U$3.27
N$46
  Bottom 0.152: R41.2 47.55,11.48 47.55,14.22 43.89,17.88 43.89,18.39 44.09,18.59 44.09,19.1 U$3.26
N$47  (via drill 0.38)
  Top 0.152: v73.97,15.24 73.97,15.65 83.72,25.4 83.72,38.1 71.42,50.39 71.42,50.6 70.31,51.71 36.88,51.71 36.78,51.82 36.37,51.82 35.87,51.31 35.87,49.89 37.19,48.56 37.19,44.81 v39.52,42.47
  Bottom 0.152: v73.97,15.24 R57.1 | v39.52,42.47 41.45,42.47 42.47,43.48 U$7.4
N$48  (via drill 0.38)
  Top 0.152: v75.49,19 75.49,23.57 76.3,24.38 76.3,25.7 73.66,28.35 71.63,28.35 70.61,29.36 70.61,47.04 68.58,49.07 57.2,49.07 49.38,41.25 46.53,41.25 v45.92,41.86
  Bottom 0.152: v75.49,19 73.05,16.56 R56.1 | v45.92,41.86 41.55,41.86 40.84,41.15 29.06,41.15 26.72,43.48 U$8.4
N$81  (via drill 0.38)
  Top 0.152: v29.97,33.53 40.74,33.53 41.55,34.34 42.98,34.34 43.99,33.33 v43.99,32.72 | v67.06,23.27 67.06,18.59 65.84,17.37 65.33,17.37 U$4.10
  Bottom 0.152: v29.97,33.53 29.97,34.44 31.09,35.56 31.7,35.56 R10.2 | v43.99,32.72 46.23,30.48 47.75,30.48 49.99,28.25 57.2,28.25 59.94,25.5 66.85,25.5 67.06,25.3 v67.06,23.27
N$82  (via drill 0.38)
  Top 0.152: v33.02,36.47 33.73,36.47 34.44,35.76 34.85,35.76 35.56,36.47 35.56,46.94 36.27,47.65 v36.27,48.56 | v68.48,38 v68.48,43.38 | v63.5,29.87 63.5,21.03 63.09,20.62 63.09,19.91 64.72,18.29 65.23,18.29 U$4.11
  Bottom 0.152: v33.02,36.47 R8.2 | v36.27,48.56 41.96,48.56 42.37,48.97 68.58,48.97 70.92,46.63 70.92,45.82 v68.48,43.38 | v68.48,38 68.48,37.08 67.46,36.07 67.46,32.21 66.04,30.79 64.41,30.79 v63.5,29.87
N$83  (via drill 0.38)
  Top 0.152: v34.65,36.47 34.65,38.61 35.26,39.22 v35.26,47.85 | v67.46,43.48 67.46,37.39 v68.89,35.97 | v68.17,25.81 66.34,23.98 66.34,19.91 65.84,19.41 65.33,19.41 U$4.12
  Bottom 0.152: v34.65,36.47 34.34,36.17 34.34,35.66 R11.2 | v35.26,47.85 53.85,47.85 53.95,47.95 62.99,47.95 v67.46,43.48 | v68.89,35.97 68.89,33.33 68.17,32.61 v68.17,25.81
N$84  (via drill 0.38)
  Top 0.152: v29.26,7.72 29.97,7.72 30.07,7.62 41.35,7.62 51.51,17.78 v62.79,17.78 | v63.8,20.42 65.13,20.42 65.23,20.32 U$4.13
  Bottom 0.152: R12.2 35.56,36.47 34.85,37.19 32.21,37.19 26.42,31.39 26.42,16.26 28.25,14.43 28.25,8.74 v29.26,7.72 | v62.79,17.78 63.91,18.9 66.85,18.9 67.06,19.1 67.06,20.22 66.85,20.42 v63.8,20.42
N$85  (via drill 0.38)
  Top 0.152: v63.8,37.59 65.02,37.59 65.23,37.39 U$4.30
  Bottom 0.152: v63.8,37.59 63.8,38.51 61.27,41.05 59.64,41.05 58.01,42.67 47.85,42.67 47.65,42.47 47.65,41.45 47.35,41.15 42.37,41.15 36.88,35.66 R13.2
N$87  (via drill 0.38)
  Top 0.152: v58.32,35.56 64.01,35.56 64.72,36.27 65.23,36.27 U$4.29
  Bottom 0.152: v58.32,35.56 47.04,35.56 R23.2
N$88  (via drill 0.38)
  Top 0.152: v58.32,34.54 62.89,34.54 63.6,35.26 65.23,35.26 U$4.28
  Bottom 0.152: v58.32,34.54 57.91,34.95 46.33,34.95 R22.2
N$89  (via drill 0.38)
  Top 0.152: v63.8,34.54 65.02,34.54 65.23,34.34 U$4.27
  Bottom 0.152: v63.8,34.54 62.08,36.27 45.11,36.27 44.5,35.66 R21.2
N$90  (via drill 0.38)
  Top 0.152: v57.61,36.98 57.61,34.34 58.52,33.43 65.13,33.43 65.23,33.33 U$4.26
  Bottom 0.152: v57.61,36.98 56.9,37.69 54.36,37.69 53.34,36.68 44.4,36.68 43.38,35.66 43.18,35.66 R19.2
N$91  (via drill 0.38)
  Top 0.152: v54.76,39.01 v53.34,37.59 | v63.8,32.72 64.82,32.72 65.23,32.31 U$4.25
  Bottom 0.152: v53.34,37.59 52.73,36.98 43.28,36.98 41.96,35.66 R18.2 | v54.76,39.01 60.25,39.01 64.52,34.75 64.52,33.43 v63.8,32.72
N$92  (via drill 0.38)
  Top 0.152: v66.75,36.07 66.75,32.31 65.84,31.39 65.33,31.39 U$4.24
  Bottom 0.152: v66.75,36.07 64.41,36.07 63.09,37.39 63.09,38.71 61.06,40.74 49.99,40.74 46.53,37.29 42.47,37.29 40.84,35.66 40.64,35.66 R17.2
N$93  (via drill 0.38)
  Top 0.152: v50.49,33.83 v46.33,38 | v63.8,31.19 64.62,30.38 65.23,30.38 U$4.23
  Bottom 0.152: v46.33,38 41.76,38 39.42,35.66 R16.2 | v50.49,33.83 61.16,33.83 v63.8,31.19
N$94  (via drill 0.38)
  Top 0.152: v48.87,40.54 56.69,40.54 64.62,48.46 68.17,48.46 69.6,47.04 v69.6,35.26 | v68.89,32.41 65.84,29.36 65.33,29.36 U$4.22
  Bottom 0.152: v48.87,40.54 43.18,40.54 38.3,35.66 38.1,35.66 R15.2 | v69.6,35.26 69.6,33.12 v68.89,32.41
N$97  (via drill 0.38)
  Top 0.152: v10.06,8.33 11.18,8.33 C18.1
  Bottom 0.152: v10.06,8.33 10.06,9.14 U$10.4
N$99  (via drill 0.38)
  Top 0.152: v63.8,41.55 65.02,41.55 65.23,41.35 U$4.34
  Bottom 0.152: v63.8,41.55 64.41,42.16 64.41,44.7 62.79,46.33 56.59,46.33 55.78,45.52 54.66,45.52 R45.2
N$100  (via drill 0.38)
  Top 0.152: v63.09,42.27 65.23,42.27 U$4.35
  Bottom 0.152: v63.09,42.27 62.08,43.28 60.45,43.28 58.32,45.41 57.2,45.41 R46.2
N$101  (via drill 0.38)
  Top 0.152: v62.99,43.28 65.23,43.28 U$4.36
  Bottom 0.152: v62.99,43.28 62.89,43.28 60.76,45.41 59.74,45.41 R47.2
N$102  (via drill 0.38)
  Top 0.152: v63.7,43.99 64.92,43.99 65.23,44.3 U$4.37
  Bottom 0.152: v63.7,43.99 62.28,45.41 R48.2
N$103  (via drill 0.38)
  Top 0.152: v73.97,7.62 70,7.62 68.17,9.45 65.43,9.45 65.33,9.35 U$4.2
  Bottom 0.152: R43.1 v73.97,7.62 R49.1
N$104  (via drill 0.38)
  Top 0.152: v69.8,8.94 v73.97,8.94 | v63.8,10.87 64.21,10.87 64.72,10.36 65.23,10.36 U$4.3
  Bottom 0.152: R52.1 73.05,8.94 v73.97,8.94 74.88,8.94 R44.1 | v69.8,8.94 68.99,8.94 67.06,10.87 v63.8,10.87
N$105  (via drill 0.38)
  Top 0.152: v69.6,12.7 68.28,11.38 65.33,11.38 U$4.4
  Bottom 0.152: R53.1 71.73,13.92 R51.1 | v69.6,12.7 R53.1 | R53.1
N$106  (via drill 0.38)
  Top 0.152: v68.48,12.5 65.43,12.5 65.33,12.39 U$4.5
  Bottom 0.152: R54.1 71.73,11.38 R50.1 71.73,11.48 69.49,11.48 v68.48,12.5
SPI1_CS0  (via drill 0.38)
  Top 0.152: v47.75,5.79 51.31,5.79 52.63,4.47 P9.28
  Bottom 0.152: v47.75,5.79 47.75,6.2 45.41,8.53 44.3,8.53 42.77,10.06 42.57,10.06 R37.1
SPI1_D0  (via drill 0.38)
  Top 0.152: v48.46,3.45 53.65,3.45 55.17,1.93 P9.29
  Bottom 0.152: v48.46,3.45 47.24,3.45 46.63,4.06 46.63,4.27 45.82,5.08 45.82,7.11 45.01,7.92 42.37,7.92 40.23,10.06 40.03,10.06 R35.1
SPI1_D1  (via drill 0.38)
  Top 0.152: v46.53,6.5 53.14,6.5 55.17,4.47 P9.30
  Bottom 0.152: v46.53,6.5 46.53,6.91 45.21,8.23 43.18,8.23 41.35,10.06 R36.1
SPI1_SCLK  (via drill 0.38)
  Top 0.152: v44.81,7.21 53.85,7.21 56.79,4.27 56.79,2.85 57.71,1.93 P9.31
  Bottom 0.152: v44.81,7.21 41.66,7.21 38.81,10.06 R32.1
TIMER4  (via drill 0.38)
  Top 0.152: v21.03,17.88 21.03,18.39 25.3,22.66 25.3,48.16 P8.7
  Bottom 0.152: v21.03,17.88 21.03,11.58 25.7,6.91 25.7,4.67 26.92,3.45 30.28,3.45 30.79,3.96 30.79,4.27 31.9,5.38 32.72,5.38 37.39,10.06 R30.1
TIMER5  (via drill 0.38)
  Top 0.152: v43.99,47.14 v49.17,41.96
  Bottom 0.152: v49.17,41.96 48.36,41.96 R24.1 | v43.99,47.14 32.82,47.14 29.87,50.09 P8.9
TIMER6  (via drill 0.38)
  Top 0.152: v33.73,43.28 33.73,45.11 34.24,45.62 34.24,46.02 30.79,49.48 30.79,51.71 29.87,52.63 P8.10
  Bottom 0.152: v33.73,43.28 32.41,41.96 R58.1
VCCB@2  (via drill 0.38)
  Top 0.152: v28.14,22.86 33.73,22.86 v36.17,25.3 36.37,25.5 v41.66,25.5 44.81,28.65 v45.11,28.65
  Bottom 0.152: v28.14,22.86 28.55,22.45 29.16,22.45 C3.1 | v36.17,25.3 36.17,26.62 U$3.7 | v41.66,25.5 41.66,26.62 U$3.18 | v45.11,28.65 47.35,28.65 49.68,26.31 49.68,24.99 48.97,24.28 48.97,23.98 C2.1
VDD
  Top 0.152: P9.5 24.79,1.93 24.79,4.37 P9.6

### Text on the board
tPlace: hitchhikeree.org | DeviantLCD
bPlace: hitchhikeree.org | DeviantLCD